# Altium project ISL6236A_DEMO_V1I1.PrjPcb
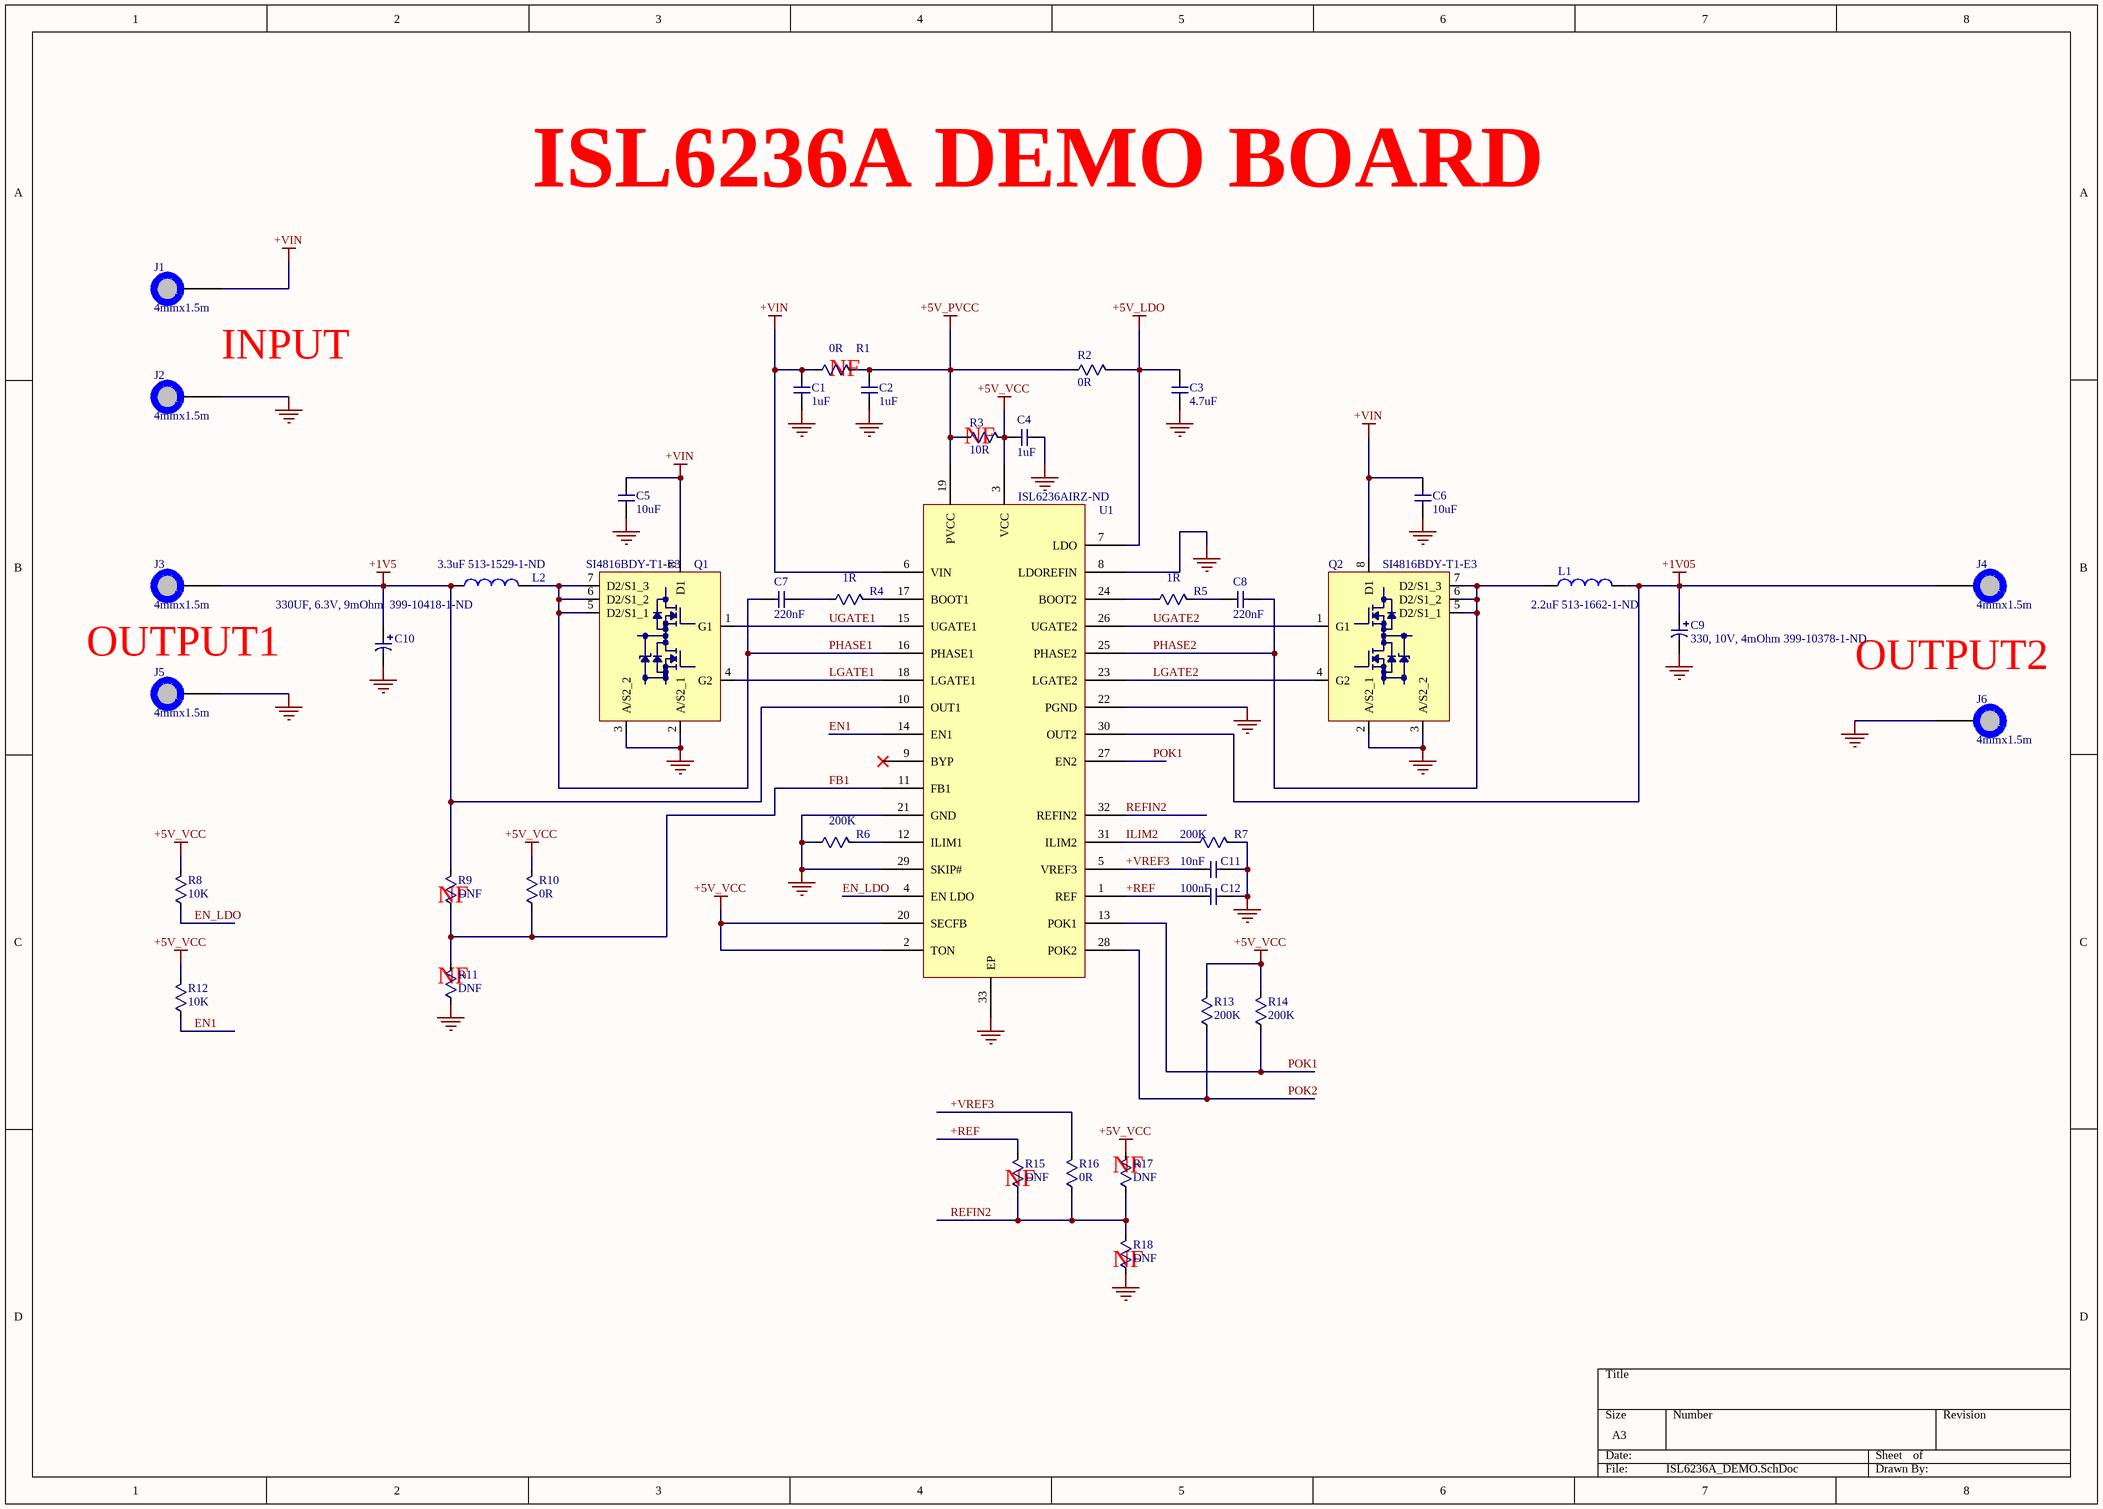
[diagram p0: ISL6236A_DEMO.SchDoc]
1 sheet, 41 parts. Net scope: global (net labels, ports and power ports of the same name join across sheets).
Board file: ISL6236A_DEMO.PcbDoc

## Sheet ISL6236A_DEMO.SchDoc
size A3

### Parts
C1  1uF  [C0805]
C2  1uF  [C0805]
C3  4.7uF  [C1206]
C4  1uF  [C0805]
C5  10uF  [C1206]
C6  10uF  [C1206]
C7  220nF  [C0805]
C8  220nF  [C0805]
C9  330, 10V, 4mOhm 399-10378-1-ND  [C7343-43]
C10  330UF, 6.3V, 9mOhm  399-10418-1-ND  [C7343-31]
C11  10nF  [C0805]
C12  100nF  [C0805]
J1  4mmx1.5m  [PAD_WITH_HOLE_4MMx1.5MM]
J2  4mmx1.5m  [PAD_WITH_HOLE_4MMx1.5MM]
J3  4mmx1.5m  [PAD_WITH_HOLE_4MMx1.5MM]
J4  4mmx1.5m  [PAD_WITH_HOLE_4MMx1.5MM]
J5  4mmx1.5m  [PAD_WITH_HOLE_4MMx1.5MM]
J6  4mmx1.5m  [PAD_WITH_HOLE_4MMx1.5MM]
L1  2.2uF 513-1662-1-ND  [DR125]
L2  3.3uF 513-1529-1-ND  [DR125]
Q1  SI4816BDY-T1-E3  [SO-8]
Q2  SI4816BDY-T1-E3  [SO-8]
R1  0R  [R0805]
R2  0R  [R0805]
R3  10R  [R0805]
R4  1R  [R0805]
R5  1R  [R0805]
R6  200K  [R0805]
R7  200K  [R0805]
R8  10K  [R0805]
R9  DNF  [R0805]
R10  0R  [R0805]
R11  DNF  [R0805]
R12  10K  [R0805]
R13  200K  [R0805]
R14  200K  [R0805]
R15  DNF  [R0805]
R16  0R  [R0805]
R17  DNF  [R0805]
R18  DNF  [R0805]
U1  ISL6236AIRZ-ND  [L32.5x5B]

### Nets
+1V5: C10.1 J3.1 L2.1 R9.2 U1.10(OUT1)
+1V05: C9.1 J4.1 L1.2 U1.30(OUT2)
+5V_LDO: C3.2 R2.2 U1.7(LDO)
+5V_PVCC: C2.2 R1.2 R2.1 R3.1 U1.19(PVCC)
+5V_VCC: C4.1 R3.2 R8.2 R10.2 R12.2 R13.2 R14.2 R17.2 U1.2(TON) U1.3(VCC) U1.20(SECFB)
+VIN: C1.2 C5.2 C6.2 J1.1 Q1.8(D1) Q2.8(D1) R1.1 U1.6(VIN)
GND: C1.1 C2.1 C3.1 C4.2 C5.1 C6.1 C9.2 C10.2 C11.2 C12.2 J2.1 J5.1 J6.1 Q1.2(A/S2_1) Q1.3(A/S2_2) Q2.2(A/S2_1) Q2.3(A/S2_2) R6.1 R7.2 R11.1 R18.1 U1.8(LDOREFIN) U1.21(GND) U1.22(PGND) U1.29(SKIP#) U1.33(EP)
+REF: C12.1 R15.2 U1.1(REF)
+VREF3: C11.1 R16.2 U1.5(VREF3)
EN1: R12.1 U1.14(EN1)
EN_LDO: R8.1 U1.4(EN_LDO)
FB1: R9.1 R10.1 R11.2 U1.11(FB1)
ILIM2: R7.1 U1.31(ILIM2)
LGATE1: Q1.4(G2) U1.18(LGATE1)
LGATE2: Q2.4(G2) U1.23(LGATE2)
PHASE1: C7.1 L2.2 Q1.5(D2/S1_1) Q1.6(D2/S1_2) Q1.7(D2/S1_3) U1.16(PHASE1)
PHASE2: C8.2 L1.1 Q2.5(D2/S1_1) Q2.6(D2/S1_2) Q2.7(D2/S1_3) U1.25(PHASE2)
POK1: R14.1 U1.13(POK1) U1.27(EN2)
POK2: R13.1 U1.28(POK2)
REFIN2: R15.1 R16.1 R17.1 R18.2 U1.32(REFIN2)
UGATE1: Q1.1(G1) U1.15(UGATE1)
UGATE2: Q2.1(G1) U1.26(UGATE2)
NetC7_2: C7.2 R4.1
NetC8_1: C8.1 R5.2
NetR4_2: R4.2 U1.17(BOOT1)
NetR5_1: R5.1 U1.24(BOOT2)
NetR6_2: R6.2 U1.12(ILIM1)

Not connected (* = marked no-connect by the designer): U1 9(BYP)*

### Notes on the sheet
- ISL6236A DEMO BOARD
- INPUT
- (near R1) NF
- (near R3) NF
- OUTPUT1
- OUTPUT2
- (near R9) NF
- (near R11) NF
- (near R15) NF
- (near R17) NF
- (near R18) NF

### Library data of the parts
C1 C2 C4 = CL21B105KBFNNNE: CAP CER 1UF 50V 10% X7R 0805; Manufacturer: Samsung Electro-Mechanics America, Inc; Capacitance: 1.0µF; Supplier 1: Digi-Key; Manufacturer Part Number: CL21B105KBFNNNE; RoHS: RoHS Compliant; Category: Capacitors; Stock 1: 1078939; Pricing 1: 1=0.1, 10=0.071, 25=0.0504, 50=0.0386, 100=0.0327, 250=0.02676, 500=0.0229, 1000=0.01785 (USD); Packaging: Cut Tape (CT); Tolerance: ±10%; Voltage - Rated: 50V; Temperature Coefficient: X7R; Mounting Type: Surface Mount, MLCC; Operating Temperature: -55°C ~ 125°C; Applications: General Purpose; Ratings: -; Package / Case: 0805 (2012 Metric); Size / Dimension: 0.079" L x 0.049" W (2.00mm x 1.25mm); Height - Seated (Max): -; Thickness (Max): 0.053" (1.35mm); Lead Spacing: -; Features: -; Lead Style: -; ComponentLink1URL: http://www.samsungsem.com/servlet/FileDownload?type=spec&file=CL21B105KBFNNNE.pdf; ComponentLink1Description: http://www.samsungsem.com/servlet/FileDownload?type=spec&file=CL21B105KBFNNNE.pdf; Supplier Part Number 1: 1276-1029-1-ND
C3 = CL31A475KPHNNNE: CAP CER 4.7UF 10V 10% X5R 1206; Manufacturer: Samsung Electro-Mechanics America, Inc; Capacitance: 4.7µF; Supplier 1: Digi-Key; Manufacturer Part Number: CL31A475KPHNNNE; RoHS: RoHS Compliant; Category: Capacitors; Stock 1: 10395; Pricing 1: 1=0.25, 10=0.173, 25=0.126, 50=0.105, 100=0.0882, 250=0.0714, 500=0.063, 1000=0.05355 (USD); Packaging: Cut Tape (CT); Tolerance: ±10%; Voltage - Rated: 10V; Temperature Coefficient: X5R; Mounting Type: Surface Mount, MLCC; Operating Temperature: -55°C ~ 85°C; Applications: General Purpose; Ratings: -; Package / Case: 1206 (3216 Metric); Size / Dimension: 0.126" L x 0.063" W (3.20mm x 1.60mm); Height - Seated (Max): -; Thickness (Max): 0.071" (1.80mm); Lead Spacing: -; Features: -; Lead Style: -; ComponentLink1URL: http://www.samsungsem.com/servlet/FileDownload?type=spec&file=CL31A475KPHNNNE.pdf; ComponentLink1Description: http://www.samsungsem.com/servlet/FileDownload?type=spec&file=CL31A475KPHNNNE.pdf; Supplier Part Number 1: 1276-1809-1-ND
C5 C6 = GRM32DF51H106ZA01L: CAP CER 10UF 50V Y5V 1210; Manufacturer: Murata Electronics North America; Capacitance: 10µF; Tolerance: -20%, +80%; Temperature Coefficient: Y5V (F); Supplier 1: Digi-Key; Manufacturer Part Number: GRM32DF51H106ZA01L; RoHS: RoHS Compliant; Category: Capacitors; Stock 1: 178449; Pricing 1: 1=0.61, 10=0.58, 50=0.346, 100=0.2811, 250=0.23356, 500=0.21192 (USD); Packaging: Cut Tape (CT); Voltage - Rated: 50V; Mounting Type: Surface Mount, MLCC; Operating Temperature: -30°C ~ 85°C; Applications: General Purpose; Ratings: -; Package / Case: 1210 (3225 Metric); Size / Dimension: 0.126" L x 0.098" W (3.20mm x 2.50mm); Height - Seated (Max): -; Thickness (Max): 0.087" (2.20mm); Lead Spacing: -; Features: -; Lead Style: -; ComponentLink1URL: http://search.murata.co.jp/Ceramy/image/img/A01X/G101/ENG/GRM32DF51H106ZA01-01.pdf; ComponentLink1Description: http://search.murata.co.jp/Ceramy/image/img/A01X/G101/ENG/GRM32DF51H106ZA01-01.pdf; Supplier Part Number 1: 490-1891-1-ND
C7 C8 = UMK212B7224KG-T: CAP CER 0.22UF 50V 10% X7R 0805; Manufacturer: Taiyo Yuden; Capacitance: 0.22µF; Supplier 1: Digi-Key; Manufacturer Part Number: UMK212B7224KG-T; RoHS: RoHS Compliant; Category: Capacitors; Stock 1: 139281; Pricing 1: 1=0.12, 10=0.083, 50=0.0478, 100=0.0394, 250=0.0332, 500=0.0278, 1000=0.02283 (USD); Packaging: Cut Tape (CT); Tolerance: ±10%; Voltage - Rated: 50V; Temperature Coefficient: X7R; Mounting Type: Surface Mount, MLCC; Operating Temperature: -55°C ~ 125°C; Applications: General Purpose; Ratings: -; Package / Case: 0805 (2012 Metric); Size / Dimension: 0.079" L x 0.049" W (2.00mm x 1.25mm); Height - Seated (Max): -; Thickness (Max): 0.053" (1.35mm); Lead Spacing: -; Features: -; Lead Style: -; ComponentLink1URL: http://www.yuden.co.jp/or/product/category/capacitor/UMK212B7224KG-T.pdf; ComponentLink1Description: http://www.yuden.co.jp/or/product/category/capacitor/UMK212B7224KG-T.pdf; Supplier Part Number 1: 587-1287-1-ND
C9 = T530X337M010ATE004: CAP TANT 330UF 10V 20% 2917; Manufacturer: Kemet; Manufacturer Size Code: X; Capacitance: 330µF; Type: Molded; Supplier 1: Digi-Key; Manufacturer Part Number: T530X337M010ATE004; RoHS: RoHS Compliant; Category: Capacitors; Stock 1: 1645; Pricing 1: 1=8.22, 10=7.685, 50=7.2876, 100=6.625, 250=5.69752 (USD); Packaging: Cut Tape (CT); Tolerance: ±20%; Voltage - Rated: 10V; ESR (Equivalent Series Resistance): 4 mOhm; Operating Temperature: -55°C ~ 125°C; Mounting Type: Surface Mount; Package / Case: 2917 (7343 Metric); Size / Dimension: 0.287" L x 0.169" W (7.30mm x 4.30mm); Height - Seated (Max): 0.169" (4.30mm); Lead Spacing: -; Features: Polymer; Lifetime @ Temp.: -; ComponentLink1URL: http://www.kemet.com/docfinder?Partnumber=T530X337M010ATE004; ComponentLink1Description: http://www.kemet.com/docfinder?Partnumber=T530X337M010ATE004; Supplier Part Number 1: 399-10378-1-ND
C10 = T520D337M006ATE009: CAP TANT 330UF 6.3V 20% 2917; Manufacturer: Kemet; Manufacturer Size Code: D; Capacitance: 330µF; Type: Molded; Lifetime @ Temp.: 2000 Hrs @ 105°C; Supplier 1: Digi-Key; Manufacturer Part Number: T520D337M006ATE009; RoHS: RoHS Compliant; Category: Capacitors; Stock 1: 2924; Pricing 1: 1=2.3, 10=1.907, 25=1.8232, 50=1.7672, 100=1.5989, 250=1.31836 (USD); Packaging: Cut Tape (CT); Tolerance: ±20%; Voltage - Rated: 6.3V; ESR (Equivalent Series Resistance): 9 mOhm; Operating Temperature: -55°C ~ 105°C; Mounting Type: Surface Mount; Package / Case: 2917 (7343 Metric); Size / Dimension: 0.287" L x 0.169" W (7.30mm x 4.30mm); Height - Seated (Max): 0.122" (3.10mm); Lead Spacing: -; Features: Polymer; ComponentLink1URL: http://www.kemet.com/Lists/ProductCatalog/Attachments/421/KEM_T2015_T520.pdf; ComponentLink1Description: http://www.kemet.com/Lists/ProductCatalog/Attachments/421/KEM_T2015_T520.pdf; Supplier Part Number 1: 399-10418-1-ND
C11 = C0805C103K5RACTU: CAP CER 10000PF 50V 10% X7R 0805; Manufacturer: Kemet; Supplier 1: Digi-Key; Manufacturer Part Number: C0805C103K5RACTU; RoHS: RoHS Compliant; Category: Capacitors; Stock 1: 650396; Pricing 1: 1=0.1, 10=0.034, 50=0.0182, 100=0.0154, 250=0.0126, 500=0.01078, 1000=0.0084 (USD); Packaging: Cut Tape (CT); Capacitance: 10000pF; Tolerance: ±10%; Voltage - Rated: 50V; Temperature Coefficient: X7R; Mounting Type: Surface Mount, MLCC; Operating Temperature: -55°C ~ 125°C; Applications: General Purpose; Ratings: -; Package / Case: 0805 (2012 Metric); Size / Dimension: 0.079" L x 0.049" W (2.00mm x 1.25mm); Height - Seated (Max): -; Thickness (Max): 0.035" (0.88mm); Lead Spacing: -; Features: -; Lead Style: -; ComponentLink1URL: http://www.kemet.com/docfinder?Partnumber=C0805C103K5RACTU; ComponentLink1Description: http://www.kemet.com/docfinder?Partnumber=C0805C103K5RACTU; Supplier Part Number 1: 399-1158-1-ND
C12 = C0805C104K5RACTU: CAP CER 0.1UF 50V 10% X7R 0805; Manufacturer: Kemet; Capacitance: 0.1µF; Supplier 1: Digi-Key; Manufacturer Part Number: C0805C104K5RACTU; RoHS: RoHS Compliant; Category: Capacitors; Stock 1: 3434440; Pricing 1: 1=0.1, 10=0.049, 25=0.0348, 50=0.0266, 100=0.0224, 250=0.01836, 1000=0.012 (USD); Packaging: Cut Tape (CT); Tolerance: ±10%; Voltage - Rated: 50V; Temperature Coefficient: X7R; Mounting Type: Surface Mount, MLCC; Operating Temperature: -55°C ~ 125°C; Applications: General Purpose; Ratings: -; Package / Case: 0805 (2012 Metric); Size / Dimension: 0.079" L x 0.049" W (2.00mm x 1.25mm); Height - Seated (Max): -; Thickness (Max): 0.035" (0.88mm); Lead Spacing: -; Features: -; Lead Style: -; ComponentLink1URL: http://www.kemet.com/docfinder?Partnumber=C0805C104K5RACTU; ComponentLink1Description: http://www.kemet.com/docfinder?Partnumber=C0805C104K5RACTU; Supplier Part Number 1: 399-1170-1-ND
J1-J6 = PAD_WITH_HOLE_4mmx1.5mm: Pad with hole with 4mmx1.5mm
L1 = DR125-2R2-R: FIXED IND 2.2UH 10.9A 4.5 MOHM; Manufacturer: Eaton Bussmann; Type: Wirewound; Material - Core: Ferrite; Inductance: 2.2µH; Tolerance: ±20%; Current - Saturation: 15A; Shielding: Shielded; Frequency - Test: 100kHz; Supplier 1: Digi-Key; Manufacturer Part Number: DR125-2R2-R; RoHS: RoHS Compliant; Category: Inductors, Coils, Chokes; Stock 1: 1076; Pricing 1: 1=1.91, 10=1.785, 50=1.4536, 100=1.326 (USD); Packaging: Cut Tape (CT); Current Rating: 10.9A; DC Resistance (DCR): 4.5 mOhm; Q @ Freq: -; Frequency - Self Resonant: -; Operating Temperature: -40°C ~ 125°C; Mounting Type: Surface Mount; Package / Case: Non Standard; Size / Dimension: 0.492" L x 0.492" W (12.50mm x 12.50mm); Height - Seated (Max): 0.236" (6.00mm); Supplier Device Package: -; ComponentLink1URL: http://www.cooperindustries.com/content/dam/public/bussmann/Electronics/Resources/product-datasheets/Bus_Elx_DS_4315_DR_Series.pdf; ComponentLink1Description: http://www.cooperindustries.com/content/dam/public/bussmann/Electronics/Resources/product-datasheets/Bus_Elx_DS_4315_DR_Series.pdf; Supplier Part Number 1: 513-1662-1-ND
L2 = DR125-3R3-R: FIXED IND 3.3UH 9.26A 6.3 MOHM; Manufacturer: Eaton Bussmann; Type: Wirewound; Material - Core: Ferrite; Inductance: 3.3µH; Tolerance: ±20%; Current - Saturation: 12.7A; Shielding: Shielded; Frequency - Test: 100kHz; Supplier 1: Digi-Key; Manufacturer Part Number: DR125-3R3-R; RoHS: RoHS Compliant; Category: Inductors, Coils, Chokes; Stock 1: 1995; Pricing 1: 1=1.91, 10=1.785, 50=1.4536, 100=1.326 (USD); Packaging: Cut Tape (CT); Current Rating: 9.26A; DC Resistance (DCR): 6.3 mOhm; Q @ Freq: -; Frequency - Self Resonant: -; Operating Temperature: -40°C ~ 125°C; Mounting Type: Surface Mount; Package / Case: Non Standard; Size / Dimension: 0.492" L x 0.492" W (12.50mm x 12.50mm); Height - Seated (Max): 0.236" (6.00mm); Supplier Device Package: -; ComponentLink1URL: http://www.cooperindustries.com/content/dam/public/bussmann/Electronics/Resources/product-datasheets/Bus_Elx_DS_4315_DR_Series.pdf; ComponentLink1Description: http://www.cooperindustries.com/content/dam/public/bussmann/Electronics/Resources/product-datasheets/Bus_Elx_DS_4315_DR_Series.pdf; Supplier Part Number 1: 513-1529-1-ND
Q1 Q2 = SI4816BDY-T1-E3: MOSFET 2N-CH 30V 5.8A 8-SOIC; Manufacturer: Vishay Siliconix; FET Type: 2 N-Channel (Half Bridge); FET Feature: Logic Level Gate; Current - Continuous Drain (Id) @ 25°C: 5.8A, 8.2A; Rds On (Max) @ Id, Vgs: 18.5 mOhm @ 6.8A, 10V; Vgs(th) (Max) @ Id: 3V @ 250µA; Gate Charge (Qg) @ Vgs: 10nC @ 5V; Power - Max: 1W, 1.25W; Supplier 1: Digi-Key; Manufacturer Part Number: SI4816BDY-T1-E3; RoHS: RoHS Compliant; Category: Discrete Semiconductor Products; Stock 1: 5957; Pricing 1: 1=1.68, 10=1.518, 25=1.3596, 100=1.2226, 250=1.08564, 500=0.9486, 1000=0.78523 (USD); Packaging: Cut Tape (CT); Drain to Source Voltage (Vdss): 30V; Input Capacitance (Ciss) @ Vds: -; Mounting Type: Surface Mount; Package / Case: 8-SOIC (0.154", 3.90mm Width); Supplier Device Package: 8-SO; ComponentLink1URL: http://www.vishay.com/docs/73026/si4816bd.pdf; ComponentLink1Description: http://www.vishay.com/docs/73026/si4816bd.pdf; Supplier Part Number 1: SI4816BDY-T1-E3CT-ND
R1 R2 R10 R16 = ERJ-6GEY0R00V: RES 0.0 OHM 1/8W JUMP 0805 SMD; Manufacturer: Panasonic Electronic Components; Resistance (Ohms): 0.0; Tolerance: Jumper; Power (Watts): 0.125W, 1/8W; Supplier 1: Digi-Key; Manufacturer Part Number: ERJ-6GEY0R00V; RoHS: RoHS Compliant; Category: Resistors; Stock 1: 746521; Pricing 1: 1=0.1, 50=0.0196, 100=0.0149, 250=0.01104, 500=0.00816, 1000=0.00544, 2500=0.00459 (USD); Packaging: Cut Tape (CT); Composition: Thick Film; Features: Automotive AEC-Q200 Qualified; Temperature Coefficient: -; Package / Case: 0805 (2012 Metric); Supplier Device Package: 0805; Size / Dimension: 0.079" L x 0.049" W (2.00mm x 1.25mm); Height: 0.028" (0.70mm); Number of Terminations: 2; ComponentLink1URL: http://industrial.panasonic.com/www-cgi/jvcr13pz.cgi?E+PZ+3+AOA0001+ERJ6GEY0R00V+7+WW; ComponentLink1Description: http://industrial.panasonic.com/www-cgi/jvcr13pz.cgi?E+PZ+3+AOA0001+ERJ6GEY0R00V+7+WW; Supplier Part Number 1: P0.0ACT-ND
R3 = ERJ-6ENF10R0V: RES 10 OHM 1/8W 1% 0805 SMD; Manufacturer: Panasonic Electronic Components; Resistance (Ohms): 10; Power (Watts): 0.125W, 1/8W; Temperature Coefficient: ±100ppm/°C; Supplier 1: Digi-Key; Manufacturer Part Number: ERJ-6ENF10R0V; RoHS: RoHS Compliant; Category: Resistors; Stock 1: 93100; Pricing 1: 1=0.1, 50=0.0288, 100=0.0219, 250=0.01624, 500=0.012, 1000=0.008, 2500=0.00675 (USD); Packaging: Cut Tape (CT); Tolerance: ±1%; Composition: Thick Film; Features: Automotive AEC-Q200 Qualified; Package / Case: 0805 (2012 Metric); Supplier Device Package: 0805; Size / Dimension: 0.079" L x 0.049" W (2.00mm x 1.25mm); Height: 0.028" (0.70mm); Number of Terminations: 2; ComponentLink1URL: http://industrial.panasonic.com/www-cgi/jvcr13pz.cgi?E+PZ+3+AOA0002+ERJ6ENF10R0V+7+WW; ComponentLink1Description: http://industrial.panasonic.com/www-cgi/jvcr13pz.cgi?E+PZ+3+AOA0002+ERJ6ENF10R0V+7+WW; Supplier Part Number 1: P10.0CCT-ND
R4 R5 = ERJ-6RQF1R0V: RES 1 OHM 1/8W 1% 0805 SMD; Manufacturer: Panasonic Electronic Components; Resistance (Ohms): 1; Power (Watts): 0.125W, 1/8W; Temperature Coefficient: ±200ppm/°C; Supplier 1: Digi-Key; Manufacturer Part Number: ERJ-6RQF1R0V; RoHS: RoHS Compliant; Category: Resistors; Stock 1: 24728; Pricing 1: 1=0.57, 50=0.2266, 100=0.1748, 250=0.13596, 500=0.09584, 1000=0.06993 (USD); Packaging: Cut Tape (CT); Tolerance: ±1%; Composition: Thick Film; Features: Automotive AEC-Q200 Qualified, Current Sense; Package / Case: 0805 (2012 Metric); Supplier Device Package: 0805; Size / Dimension: 0.079" L x 0.049" W (2.00mm x 1.25mm); Height: 0.028" (0.70mm); Number of Terminations: 2; ComponentLink1URL: http://industrial.panasonic.com/www-cgi/jvcr13pz.cgi?E+PZ+3+AOA0003+ERJ6RQF1R0V+7+WW; ComponentLink1Description: http://industrial.panasonic.com/www-cgi/jvcr13pz.cgi?E+PZ+3+AOA0003+ERJ6RQF1R0V+7+WW; Supplier Part Number 1: P1.0DCT-ND
R6 R7 R13 R14 = RMCF0805FT200K: RES 200K OHM 1/8W 1% 0805; Manufacturer: Stackpole Electronics Inc; Power (Watts): 0.125W, 1/8W; Temperature Coefficient: ±100ppm/°C; Supplier 1: Digi-Key; Manufacturer Part Number: RMCF0805FT200K; RoHS: RoHS Compliant; Category: Resistors; Stock 1: 27645; Pricing 1: 1=0.1, 10=0.029, 50=0.0162, 100=0.0123, 250=0.00912, 500=0.00672, 1000=0.00448, 2500=0.00378 (USD); Packaging: Cut Tape (CT); Resistance (Ohms): 200k; Tolerance: ±1%; Composition: Thick Film; Features: -; Package / Case: 0805 (2012 Metric); Supplier Device Package: 0805; Size / Dimension: 0.079" L x 0.049" W (2.00mm x 1.25mm); Height: 0.026" (0.65mm); Number of Terminations: 2; ComponentLink1URL: http://www.seielect.com/Catalog/SEI-RMCF_RMCP.pdf; ComponentLink1Description: http://www.seielect.com/Catalog/SEI-RMCF_RMCP.pdf; Supplier Part Number 1: RMCF0805FT200KCT-ND
R8 R12 = ERJ-6GEYJ103V: RES 10K OHM 1/8W 5% 0805 SMD; Manufacturer: Panasonic Electronic Components; Power (Watts): 0.125W, 1/8W; Temperature Coefficient: ±200ppm/°C; Supplier 1: Digi-Key; Manufacturer Part Number: ERJ-6GEYJ103V; RoHS: RoHS Compliant; Category: Resistors; Stock 1: 1883616; Pricing 1: 1=0.1, 50=0.0196, 100=0.0149, 250=0.01104, 500=0.00816, 1000=0.00544, 2500=0.00459 (USD); Packaging: Cut Tape (CT); Resistance (Ohms): 10k; Tolerance: ±5%; Composition: Thick Film; Features: Automotive AEC-Q200 Qualified; Package / Case: 0805 (2012 Metric); Supplier Device Package: 0805; Size / Dimension: 0.079" L x 0.049" W (2.00mm x 1.25mm); Height: 0.028" (0.70mm); Number of Terminations: 2; ComponentLink1URL: http://industrial.panasonic.com/www-cgi/jvcr13pz.cgi?E+PZ+3+AOA0001+ERJ6GEYJ103V+7+WW; ComponentLink1Description: http://industrial.panasonic.com/www-cgi/jvcr13pz.cgi?E+PZ+3+AOA0001+ERJ6GEYJ103V+7+WW; Supplier Part Number 1: P10KACT-ND
R9 R11 R15 R17 R18 = RES
U1 = ISL6236AIRZ: IC MAIN PWR CTRLR QUAD 32-QFN; Manufacturer: Intersil; Voltage - Input: 4.5 V ~ 25 V; Number of Outputs: 4; Voltage - Output: Multiple; Supplier 1: Digi-Key; Manufacturer Part Number: ISL6236AIRZ; RoHS: RoHS Compliant; Category: Integrated Circuits (ICs); Stock 1: 0; Pricing 1: 600=3.65 (USD); Packaging: Tube; Applications: Controller, Notebook Power System; Operating Temperature: -40°C ~ 100°C; Mounting Type: Surface Mount; Package / Case: 32-VFQFN Exposed Pad; Supplier Device Package: 32-QFN (5x5); ComponentLink1URL: http://www.intersil.com/content/dam/Intersil/documents/fn64/fn6453.pdf; ComponentLink1Description: http://www.intersil.com/content/dam/Intersil/documents/fn64/fn6453.pdf; Supplier Part Number 1: ISL6236AIRZ-ND